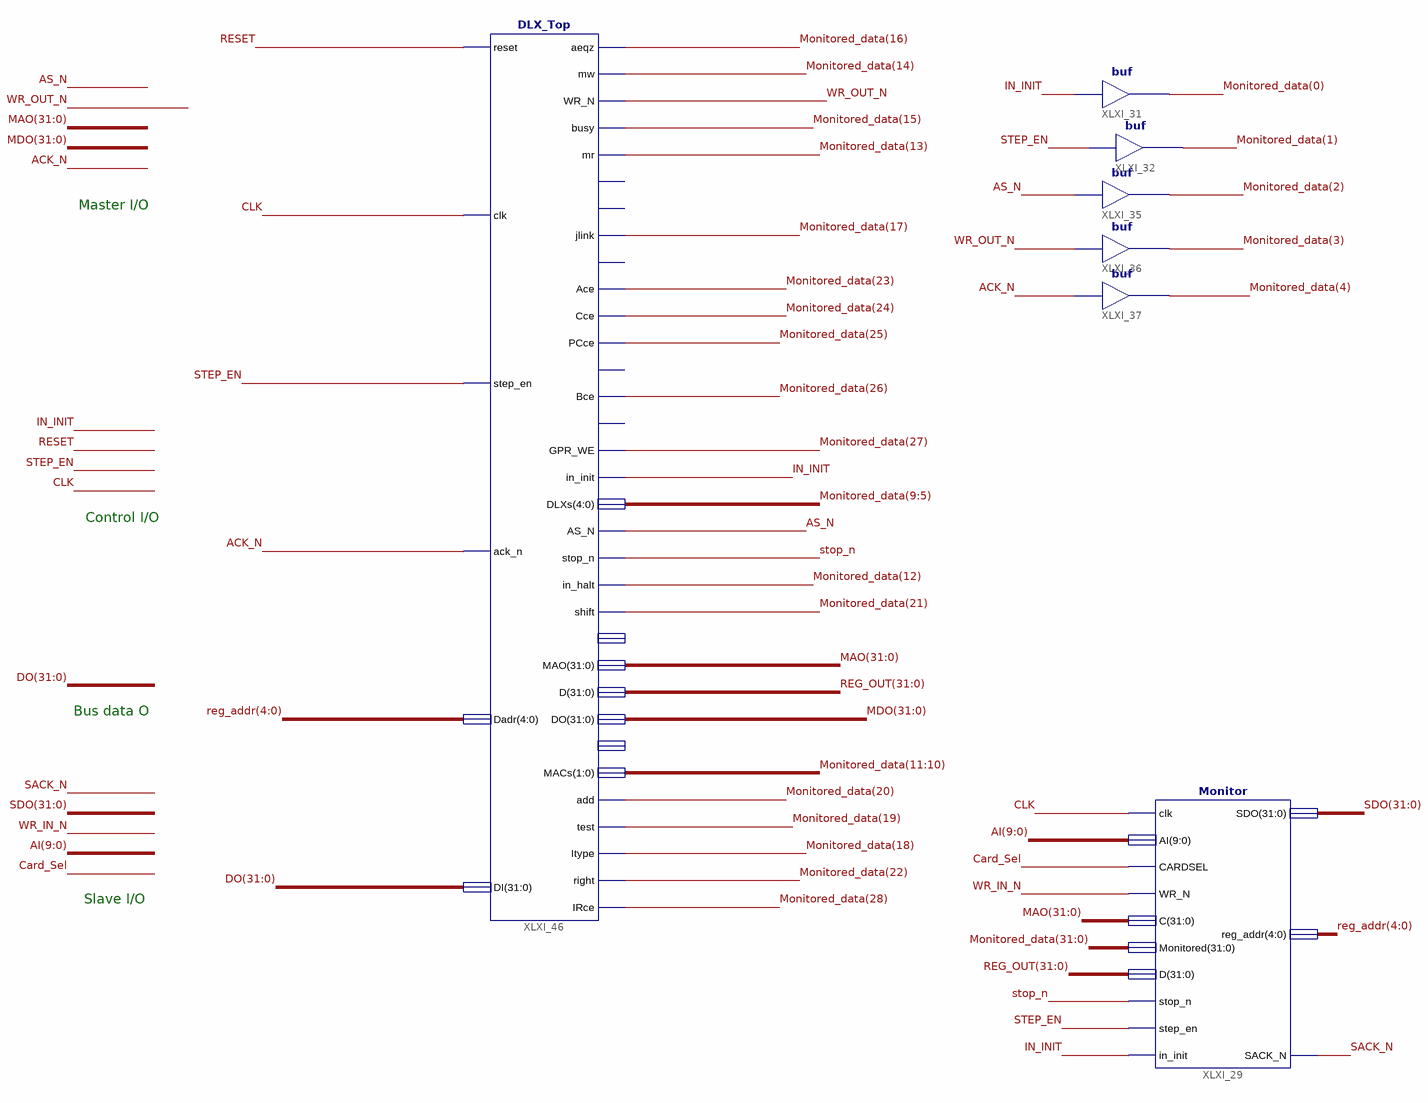
[diagram p0: schematic sheet 1]
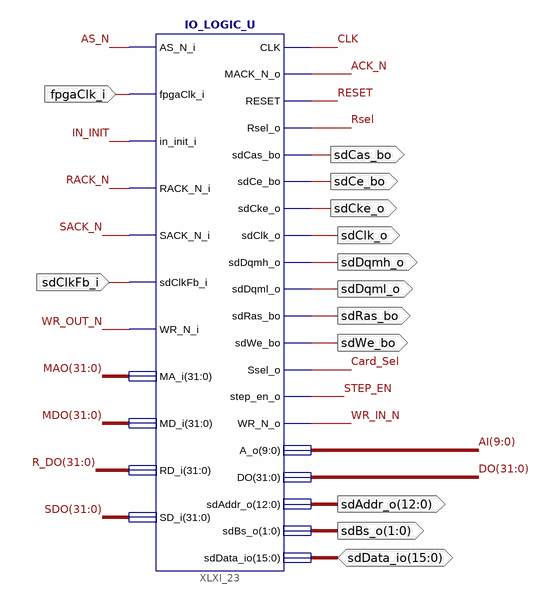
[diagram p1: schematic sheet 2]
// Xilinx ISE schematic Top_Level.sch (spartan6) as structural Verilog: 8 symbols, 13 ports
module Top_Level (
  input  fpgaClk_i,
  input  sdClkFb_i,
  inout  [15:0] sdData_io,
  output sdClk_o,
  output [1:0] sdBs_o,
  output sdDqml_o,
  output sdDqmh_o,
  output sdWe_bo,
  output sdCas_bo,
  output sdRas_bo,
  output sdCe_bo,
  output sdCke_o,
  output [12:0] sdAddr_o
);

  wire ACK_N, AS_N, Card_Sel, CLK, IN_INIT, RACK_N, RESET, Rsel, SACK_N, STEP_EN, stop_n, WR_IN_N, WR_OUT_N;
  wire [4:0] reg_addr;
  wire [9:0] AI;
  wire [31:0] DO, MAO, MDO, Monitored_data, R_DO, REG_OUT, SDO;

  IO_LOGIC_U XLXI_23 (
    .AS_N_i(AS_N), .fpgaClk_i(fpgaClk_i), .in_init_i(IN_INIT), .RACK_N_i(RACK_N), .SACK_N_i(SACK_N),
    .sdClkFb_i(sdClkFb_i), .WR_N_i(WR_OUT_N), .MA_i(MAO), .MD_i(MDO), .RD_i(R_DO), .SD_i(SDO), .CLK(CLK),
    .MACK_N_o(ACK_N), .RESET(RESET), .Rsel_o(Rsel), .sdCas_bo(sdCas_bo), .sdCe_bo(sdCe_bo),
    .sdCke_o(sdCke_o), .sdClk_o(sdClk_o), .sdDqmh_o(sdDqmh_o), .sdDqml_o(sdDqml_o), .sdRas_bo(sdRas_bo),
    .sdWe_bo(sdWe_bo), .Ssel_o(Card_Sel), .step_en_o(STEP_EN), .WR_N_o(WR_IN_N), .A_o(AI), .DO(DO),
    .sdAddr_o(sdAddr_o), .sdBs_o(sdBs_o), .sdData_io(sdData_io));
  buf XLXI_35 (Monitored_data[2], AS_N);
  buf XLXI_36 (Monitored_data[3], WR_OUT_N);
  buf XLXI_37 (Monitored_data[4], ACK_N);
  Monitor XLXI_29 (
    .clk(CLK), .AI(AI), .CARDSEL(Card_Sel), .WR_N(WR_IN_N), .C(MAO), .Monitored(Monitored_data), .D(REG_OUT),
    .stop_n(stop_n), .step_en(STEP_EN), .in_init(IN_INIT), .SDO(SDO), .reg_addr(reg_addr), .SACK_N(SACK_N));
  DLX_Top XLXI_46 (
    .reset(RESET), .clk(CLK), .step_en(STEP_EN), .ack_n(ACK_N), .Dadr(reg_addr), .DI(DO),
    .aeqz(Monitored_data[16]), .mw(Monitored_data[14]), .WR_N(WR_OUT_N), .busy(Monitored_data[15]),
    .mr(Monitored_data[13]), .jlink(Monitored_data[17]), .Ace(Monitored_data[23]), .Cce(Monitored_data[24]),
    .PCce(Monitored_data[25]), .Bce(Monitored_data[26]), .GPR_WE(Monitored_data[27]), .in_init(IN_INIT),
    .DLXs(Monitored_data[9:5]), .AS_N(AS_N), .stop_n(stop_n), .in_halt(Monitored_data[12]),
    .shift(Monitored_data[21]), .MAO(MAO), .D(REG_OUT), .DO(MDO), .MACs(Monitored_data[11:10]),
    .add(Monitored_data[20]), .test(Monitored_data[19]), .Itype(Monitored_data[18]),
    .right(Monitored_data[22]), .IRce(Monitored_data[28]));  // open: Asel, MDRsel, DINTsel, MARce, MDRce, S1sel, S2sel
  buf XLXI_31 (Monitored_data[0], IN_INIT);
  buf XLXI_32 (Monitored_data[1], STEP_EN);

  // Notes on the sheet:
  //   Master I/O
  //   Control I/O
  //   Bus data O
  //   Slave I/O
endmodule
